# EAGLE design ioboard-right (EAGLE 9.6.2)
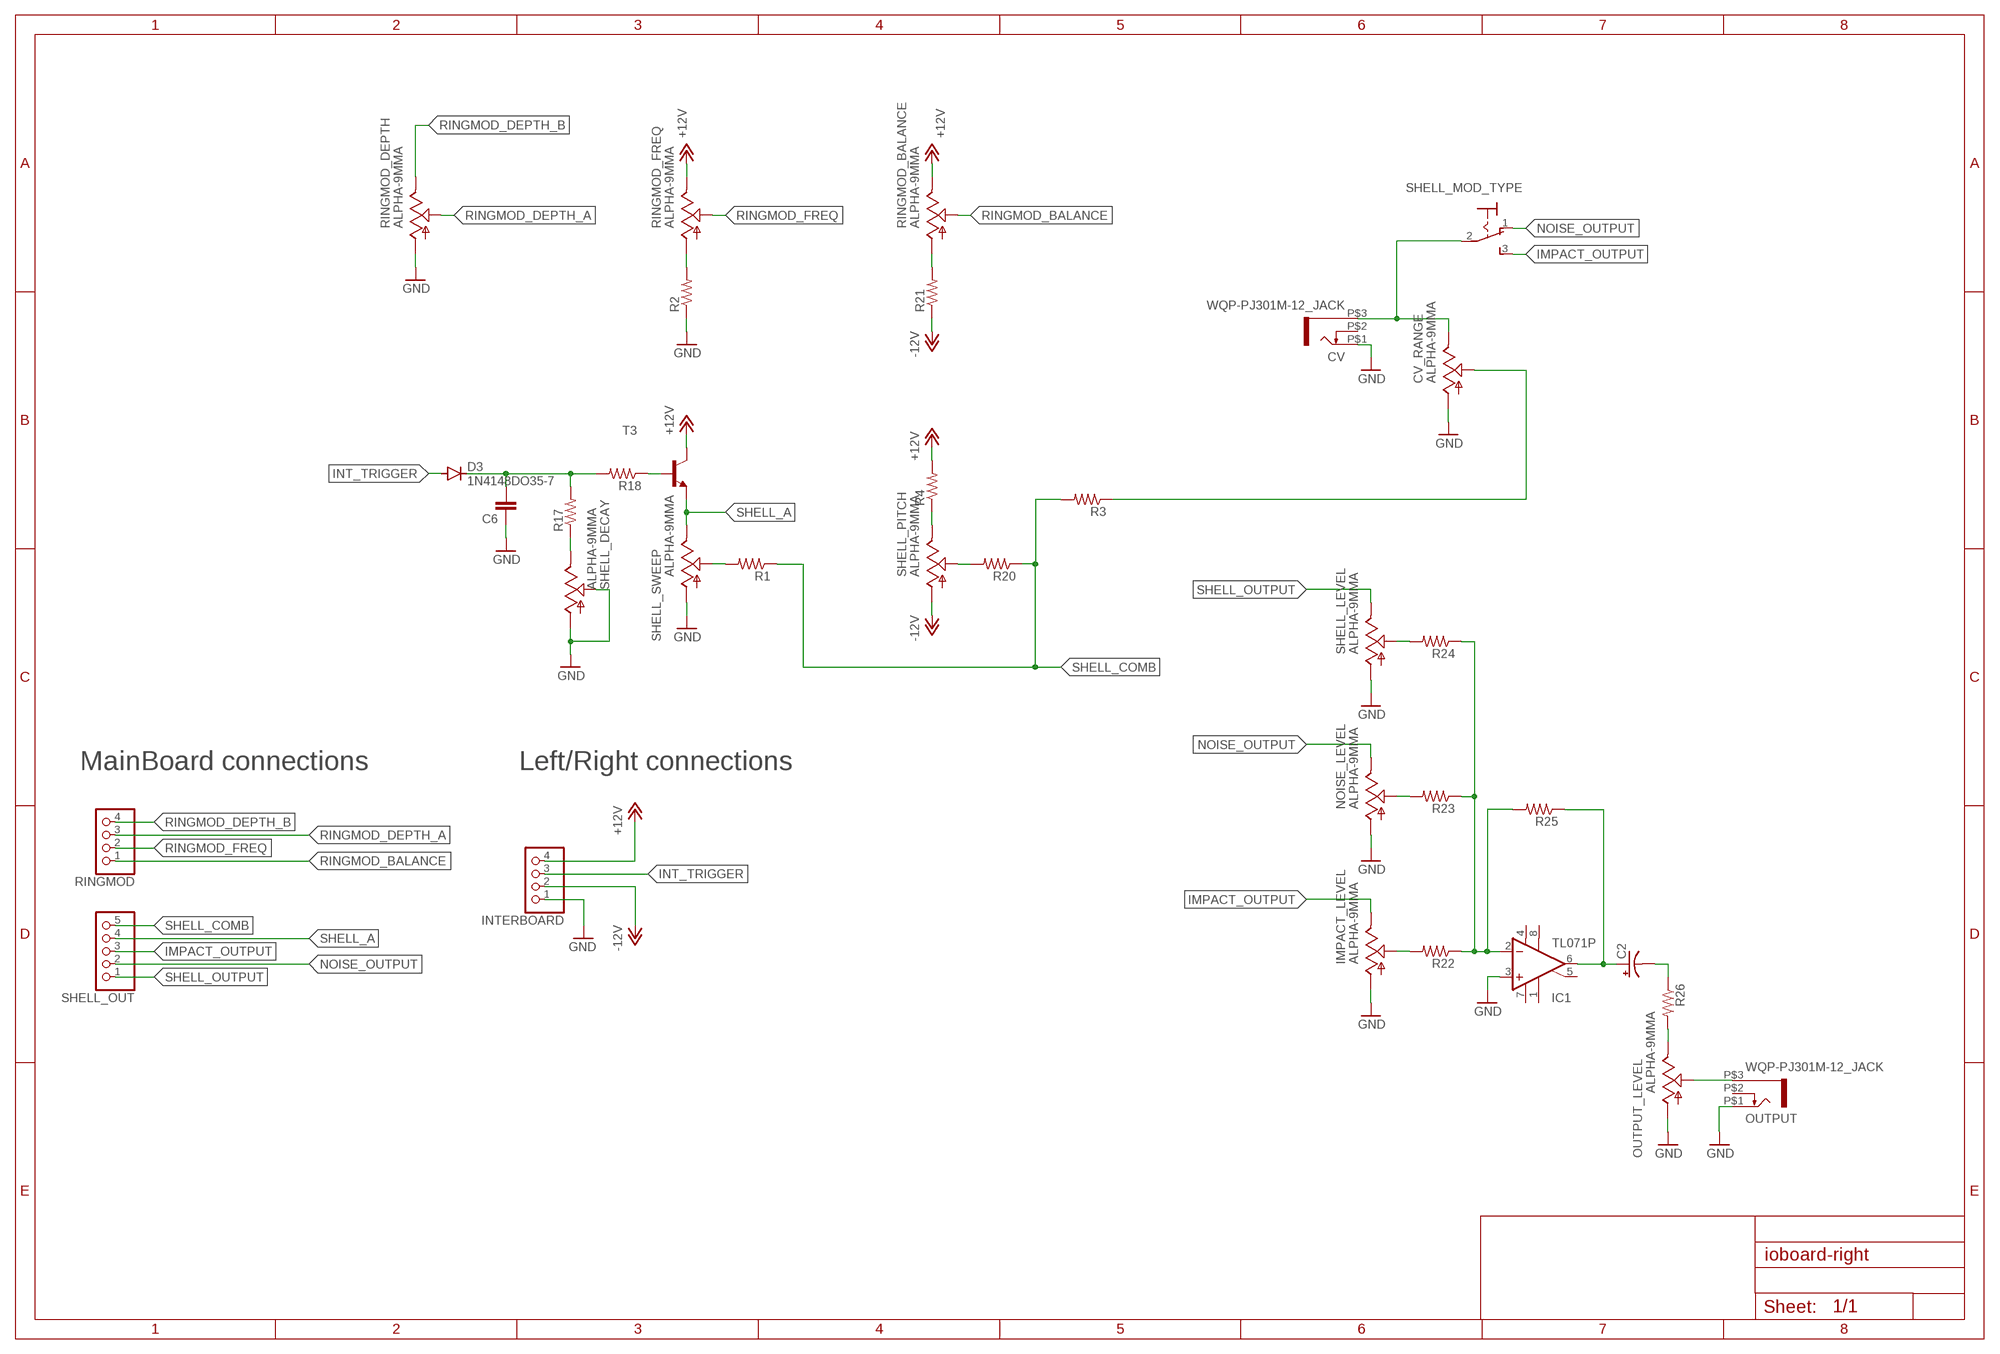
[diagram p0: schematic, sheet 1]

## Parts
C2  CPOL-USE2.5-6  [E2,5-6]
C6  C-EU050-024X044  [C050-024X044]
CV  WQP-PJ301M-12_JACK  [WQP-PJ301M-12_JACK]
CV_RANGE  ALPHA-9MMA  [EVUF]
D3  1N4148DO35-7  [DO35-7]
IC1  TL071P  [DIL08]
IMPACT_LEVEL  ALPHA-9MMA  [EVUF]
INTERBOARD  PINHD-1X4  [1X04]
NOISE_LEVEL  ALPHA-9MMA  [EVUF]
OUTPUT  WQP-PJ301M-12_JACK  [WQP-PJ301M-12_JACK]
OUTPUT_LEVEL  ALPHA-9MMA  [EVUF]
R1  R-US_0207/7  [0207/7]
R2  R-US_0207/7  [0207/7]
R3  R-US_0207/7  [0207/7]
R4  R-US_0207/7  [0207/7]
R17  R-US_0207/7  [0207/7]
R18  R-US_0207/7  [0207/7]
R20  R-US_0207/7  [0207/7]
R21  R-US_0207/7  [0207/7]
R22  R-US_0207/7  [0207/7]
R23  R-US_0207/7  [0207/7]
R24  R-US_0207/7  [0207/7]
R25  R-US_0207/7  [0207/7]
R26  R-US_0207/7  [0207/7]
RINGMOD  PINHD-1X4  [1X04]
RINGMOD_BALANCE  ALPHA-9MMA  [EVUF]
RINGMOD_DEPTH  ALPHA-9MMA  [EVUF]
RINGMOD_FREQ  ALPHA-9MMA  [EVUF]
SHELL_DECAY  ALPHA-9MMA  [EVUF]
SHELL_LEVEL  ALPHA-9MMA  [EVUF]
SHELL_MOD_TYPE  M9040P  [M9040P]
SHELL_OUT  PINHD-1X5  [1X05]
SHELL_PITCH  ALPHA-9MMA  [EVUF]
SHELL_SWEEP  ALPHA-9MMA  [EVUF]
T3  2N3904-NPN-TO92-EBC  [TO92-EBC]

## Nets
+12V: INTERBOARD.4 R4.2 RINGMOD_BALANCE.3(E) RINGMOD_FREQ.3(E) T3.C
-12V: INTERBOARD.2 R21.1 SHELL_PITCH.1(A)
GND: C6.1 CV.P$1 CV_RANGE.1(A) IC1.3(+IN) IMPACT_LEVEL.1(A) INTERBOARD.1 NOISE_LEVEL.1(A) OUTPUT.P$1 OUTPUT_LEVEL.1(A) R2.1 RINGMOD_DEPTH.1(A) SHELL_DECAY.1(A) SHELL_DECAY.2(S) SHELL_LEVEL.1(A) SHELL_SWEEP.1(A)
IMPACT_OUTPUT: IMPACT_LEVEL.3(E) SHELL_MOD_TYPE.3(S) SHELL_OUT.3
INT_TRIGGER: D3.A INTERBOARD.3
N$1: R1.2 SHELL_SWEEP.2(S)
N$3: CV_RANGE.2(S) R3.1
N$24: C6.2 D3.C R17.2 R18.2
N$25: R18.1 T3.B
N$27: R17.1 SHELL_DECAY.3(E)
N$31: R2.2 RINGMOD_FREQ.1(A)
N$32: R21.2 RINGMOD_BALANCE.1(A)
N$34: R4.1 SHELL_PITCH.3(E)
N$35: R20.2 SHELL_PITCH.2(S)
N$37: CV.P$3 CV_RANGE.3(E) SHELL_MOD_TYPE.2(P)
N$39: IMPACT_LEVEL.2(S) R22.2
N$40: NOISE_LEVEL.2(S) R23.2
N$41: R24.2 SHELL_LEVEL.2(S)
N$45: IC1.2(-IN) R22.1 R23.1 R24.1 R25.2
N$46: OUTPUT_LEVEL.3(E) R26.2
N$47: OUTPUT.P$3 OUTPUT_LEVEL.2(S)
N$48: C2.+ IC1.6(OUT) R25.1
N$49: C2.- R26.1
NOISE_OUTPUT: NOISE_LEVEL.3(E) SHELL_MOD_TYPE.1(O) SHELL_OUT.2
RINGMOD_BALANCE: RINGMOD.1 RINGMOD_BALANCE.2(S)
RINGMOD_DEPTH_A: RINGMOD.3 RINGMOD_DEPTH.2(S)
RINGMOD_DEPTH_B: RINGMOD.4 RINGMOD_DEPTH.3(E)
RINGMOD_FREQ: RINGMOD.2 RINGMOD_FREQ.2(S)
SHELL_A: SHELL_OUT.4 SHELL_SWEEP.3(E) T3.E
SHELL_COMB: R1.1 R3.2 R20.1 SHELL_OUT.5
SHELL_OUTPUT: SHELL_LEVEL.3(E) SHELL_OUT.1
Unconnected: CV.P$2 IC1.1(ON1) IC1.5(ON2) IC1.8(OPT) OUTPUT.P$2

## Notes on the sheet
- MainBoard connections | Left/Right connections

## Power pins joined to a net without a drawn wire
V+: IC1.7(V+)
V-: IC1.4(V-)

## Library data of the parts
C2 = rcl:CPOL-US: POLARIZED CAPACITOR, American symbol; SPICEPREFIX: C
C6 = rcl:C-EU: CAPACITOR, European symbol; SPICEPREFIX: C
CV OUTPUT = thonkiconn:WQP-PJ301M-12_JACK
CV_RANGE IMPACT_LEVEL NOISE_LEVEL OUTPUT_LEVEL RINGMOD_BALANCE RINGMOD_DEPTH RINGMOD_FREQ SHELL_DECAY SHELL_LEVEL SHELL_PITCH SHELL_SWEEP = TomW:ALPHA-9MM: 9 mm Square Rotary Potentiometers Source: Panasonic
D3 = diode:1N4148: DIODE high speed (Philips)
IC1 = linear:TL071: OP AMP
INTERBOARD RINGMOD = pinhead:PINHD-1X4: PIN HEADER
R1-R4 R17 R18 R20-R26 = rcl:R-US_: RESISTOR, American symbol; SPICEPREFIX: R
SHELL_MOD_TYPE = switch:M9040P: TOGGLE SWITCH Marquardt
SHELL_OUT = pinhead:PINHD-1X5: PIN HEADER
T3 = transistor-neu-to92:*-NPN-: NPN Transistror

## Board
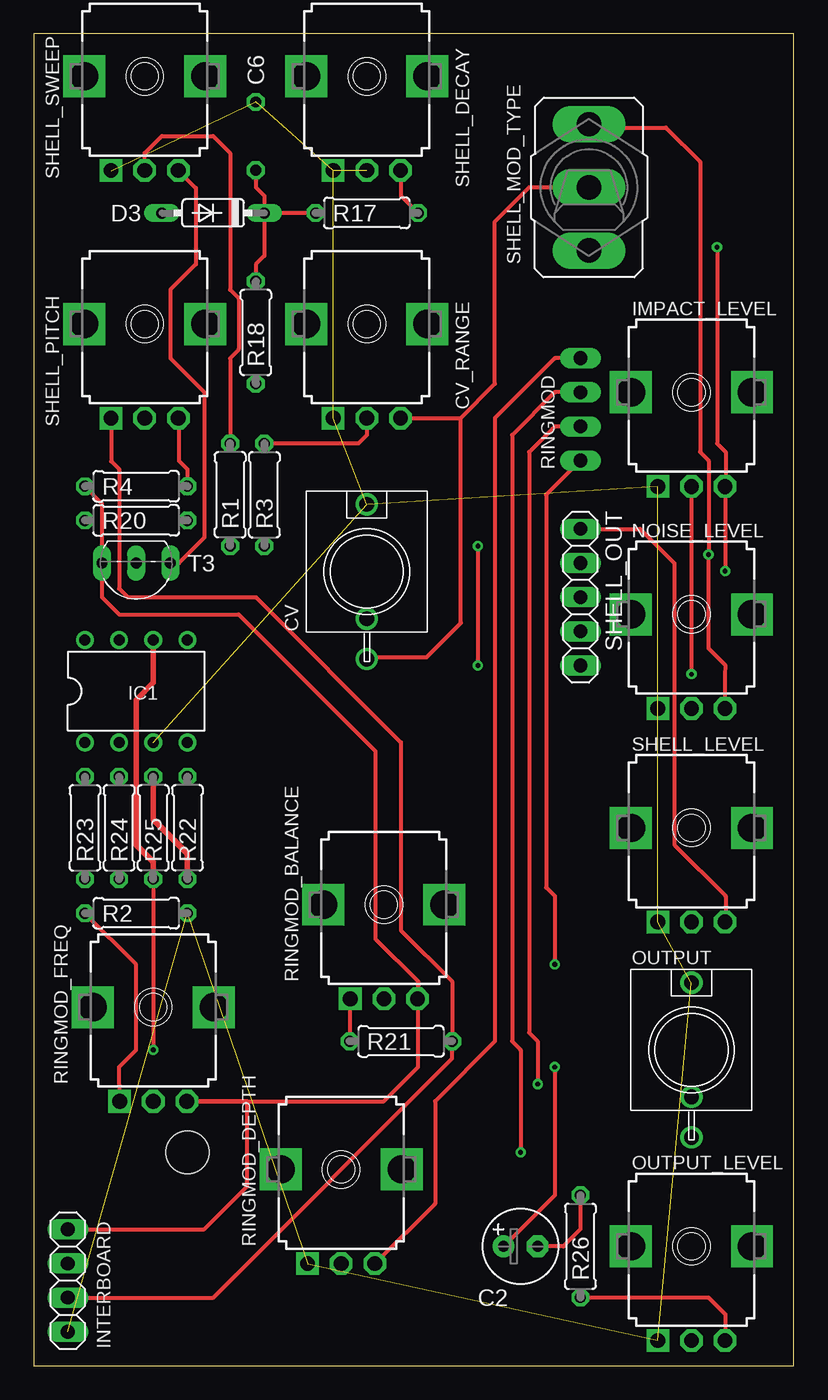
[diagram p1: board, top side]
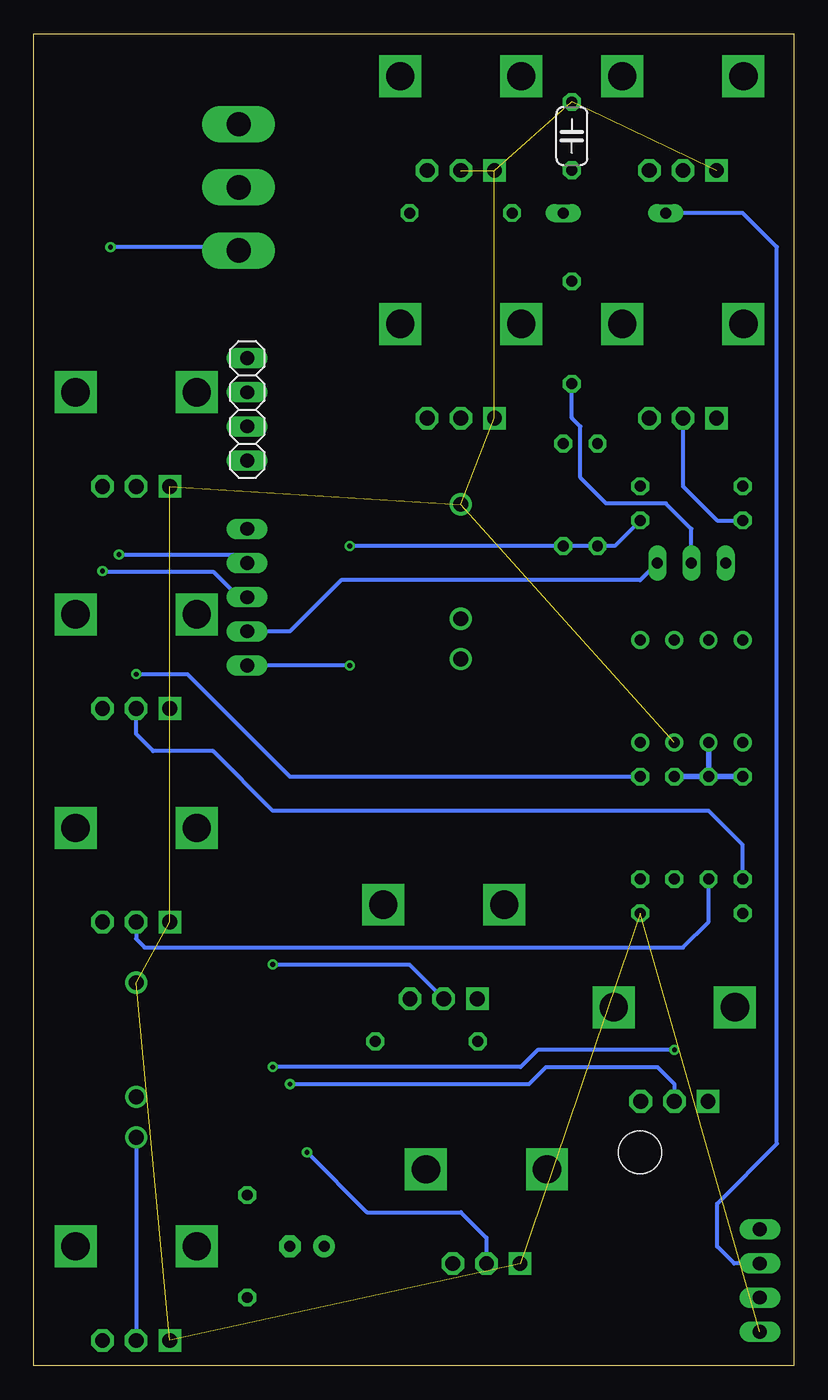
[diagram p2: board, bottom side, seen from below]

Size 56.52 x 99.06 mm. Coordinates in mm from the lower left corner, seen from the top.
Outline: 0,0 56.52,0 56.52,99.06 0,99.05 0,0
Copper layers (1*16): Top 0.035mm / dielectric 1.5mm / Bottom 0.035mm
Design rules "default": minimum track width 6mil, minimum drill 0.35mm, track to track 6mil, track to pad 6mil, pad to pad 6mil, via to via 6mil, smd to smd 6mil, copper to edge 40mil, drill to drill 6mil, minimum pad ring 10mil, minimum via ring 8mil, stop-mask expansion 4mil, vias tented up to drill 0mil, thermal gap 10mil
Holes 3.2 mm at 11.43,15.88

### Footprints (pad centres in the part's own frame; a part is rotated, then mirrored left to right if it is on the bottom)
E2,5-6 = drill 0.813 pad 1.6: + -1.27,0 | drill 0.813 pad 1.6 octagon: - 1.27,0
C050-024X044 = drill 0.813 octagon: 1 -2.54,0; 2 2.54,0
WQP-PJ301M-12_JACK = drill 1.1: P$1 0,5; P$2 0,-3.5; P$3 0,-6.5
EVUF = drill 1.1 pad 1.676 square: 1 -2.5,-7 | drill 1.1 pad 1.676 octagon: 2 0,-7; 3 2.5,-7 | drill 2.1 pad 2.8 square: M1 4.5,0; M2 -4.5,0
DO35-7 = drill 0.813 long: A 3.81,0; C -3.81,0
DIL08 = drill 0.813 pad 1.27: 1 -3.81,-3.81; 2 -1.27,-3.81; 3 1.27,-3.81; 4 3.81,-3.81; 5 3.81,3.81; 6 1.27,3.81; 7 -1.27,3.81; 8 -3.81,3.81
1X04 = drill 1.016 long: 1 -3.81,0; 2 -1.27,0; 3 1.27,0; 4 3.81,0
0207/7 = drill 0.813 octagon: 1 -3.81,0; 2 3.81,0
M9040P = drill 1.803 long: 1 0,4.699; 2 0,0; 3 0,-4.699
1X05 = drill 1.016 long: 1 -5.08,0; 2 -2.54,0; 3 0,0; 4 2.54,0; 5 5.08,0
TO92-EBC = drill 0.813 long: B 0,-1.27; C 2.54,-1.27; E -2.54,-1.27

### Placement (x,y rotation side)
C2  36.2,8.89 0 top
C6  16.51,91.44 270 bottom
CV  24.77,59.05 0 top
CV_RANGE  24.77,77.47 0 top
D3  13.34,85.72 180 top
IC1  7.62,50.16 0 top
IMPACT_LEVEL  48.9,72.39 0 top
INTERBOARD  2.54,6.35 90 top
NOISE_LEVEL  48.9,55.88 0 top
OUTPUT  48.9,23.5 0 top
OUTPUT_LEVEL  48.9,8.89 0 top
R1  14.61,64.77 90 top
R2  7.62,33.66 180 top
R3  17.14,64.77 270 top
R4  7.62,65.41 180 top
R17  24.77,85.72 180 top
R18  16.51,76.83 90 top
R20  7.62,62.87 180 top
R21  27.3,24.13 180 top
R22  11.43,40.01 90 top
R23  3.81,40.01 270 top
R24  6.35,40.01 270 top
R25  8.89,40.01 90 top
R26  40.64,8.89 270 top
RINGMOD  40.64,71.12 90 bottom
RINGMOD_BALANCE  26.04,34.29 0 top
RINGMOD_DEPTH  22.86,14.61 0 top
RINGMOD_FREQ  8.89,26.67 0 top
SHELL_DECAY  24.77,95.89 0 top
SHELL_LEVEL  48.9,40.01 0 top
SHELL_MOD_TYPE  41.27,87.63 0 top
SHELL_OUT  40.64,57.15 270 top
SHELL_PITCH  8.26,77.47 0 top
SHELL_SWEEP  8.26,95.89 0 top
T3  7.62,58.42 180 top

### Tracks (layer width: path | path; a pad name or v marks a point on that pad's centre or on a via)
+12V
  Top 0.305: R4.2 5.08,64.14 T3.C 5.08,57.15 6.35,55.88 15.24,55.88 25.4,45.72 25.4,31.73 28.57,28.57 | INTERBOARD.4 12.7,10.16 15.88,13.34 15.88,19.68 11.43,19.67 | RINGMOD_FREQ.3 26.03,19.68 28.57,22.23 28.57,28.57 | 28.57,28.57 RINGMOD_BALANCE.3
  Top 0.406: 11.43,19.67 RINGMOD_FREQ.3
-12V
  Top 0.305: INTERBOARD.2 13.34,5.08 31.11,22.86 R21.1 31.11,28.57 27.3,32.38 27.3,46.35 16.51,57.15 6.99,57.15 6.35,57.78 6.35,66.67 5.75,67.27 SHELL_PITCH.1
GND  (14 unrouted)
IMPACT_OUTPUT  (via drill 0.35)
  Top 0.305: 51.44,65.39 51.44,67.94 50.8,68.58 v50.8,83.19 | IMPACT_LEVEL.3 v51.4,59.09
  Top 0.406: 51.44,65.39 IMPACT_LEVEL.3
  Bottom 0.305: SHELL_MOD_TYPE.3 arc60 41.27,83.19 v50.8,83.19 | v51.4,59.09 51.44,59.05 43.18,59.05 41.27,57.15 SHELL_OUT.3
INT_TRIGGER
  Bottom 0.305: INTERBOARD.3 4.45,7.62 5.71,8.89 5.71,12.06 1.27,16.51 1.27,83.19 3.81,85.72 D3.A
N$1
  Top 0.305: R1.2 14.61,74.93 15.24,75.56 15.24,79.38 14.61,80.01 14.61,90.17 13.34,91.44 9.53,91.44 8.26,90.17 SHELL_SWEEP.2
N$3
  Top 0.305: CV_RANGE.2 24.77,69.22 24.13,68.58 R3.1
N$24
  Top 0.305: C6.2 16.51,87.63 17.14,87 D3.C | D3.C 17.14,82.55 16.51,81.92 R18.2 | R17.2 D3.C
N$25
  Bottom 0.305: T3.B 7.62,62.23 9.53,64.14 13.97,64.14 15.88,66.04 15.88,69.85 16.51,70.48 R18.1
N$27
  Top 0.305: 27.3,88.84 27.3,87 R17.1
  Top 0.406: SHELL_DECAY.3 27.3,88.84
N$31
  Top 0.305: RINGMOD_FREQ.1 6.35,22.23 7.62,23.5 7.62,29.84 R2.2
N$32
  Top 0.305: 23.5,27.29 R21.2
  Top 0.406: RINGMOD_BALANCE.1 23.5,27.29
N$34
  Top 0.305: 10.79,70.43 10.79,67.31 11.43,66.67 R4.1
  Top 0.406: SHELL_PITCH.3 10.79,70.43
N$35
  Bottom 0.305: SHELL_PITCH.2 8.26,65.41 5.71,62.87 R20.2
N$37
  Top 0.305: SHELL_MOD_TYPE.2 36.83,87.63 34.29,85.09 34.29,73.03 31.75,70.48 | 27.27,70.48 31.75,70.48 | 24.77,52.7 29.21,52.7 31.75,55.24 31.75,70.48
  Top 0.406: CV_RANGE.3 27.27,70.48 | CV.P$3 24.77,52.7
N$39  (via drill 0.35)
  Top 0.305: IMPACT_LEVEL.2 v48.9,51.44
  Bottom 0.305: v48.9,51.44 45.09,51.44 37.47,43.81 R22.2
N$40
  Bottom 0.305: R23.2 3.81,38.73 6.35,41.27 38.73,41.27 43.18,45.72 47.62,45.72 48.9,46.99 NOISE_LEVEL.2
N$41
  Bottom 0.305: SHELL_LEVEL.2 48.9,31.75 48.26,31.11 8.26,31.11 6.35,33.02 R24.2
N$45
  Top 0.406: R25.2 8.89,40.64 11.43,38.1 R22.1
  Bottom 0.406: IC1.2 R24.1 | R24.1 R25.2 | R23.1 R24.1
N$46
  Top 0.305: 51.44,1.91 51.44,3.81 50.16,5.08 R26.2
  Top 0.406: OUTPUT_LEVEL.3 51.44,1.91
N$47
  Bottom 0.305: OUTPUT.P$3 OUTPUT_LEVEL.2
N$48  (via drill 0.35)
  Top 0.305: R25.1 v8.89,23.5 | C2.+ 38.73,12.7 v38.73,22.23
  Top 0.406: IC1.6 8.89,50.8 7.62,49.53 7.62,38.73 8.89,37.47 R25.1
  Bottom 0.305: v8.89,23.5 19.05,23.5 20.32,22.23 v38.73,22.23
N$49
  Top 0.305: R26.1 40.64,10.16 39.37,8.89 C2.-
NOISE_OUTPUT  (via drill 0.35)
  Top 0.305: NOISE_LEVEL.3 51.4,51.4 51.44,52.07 50.16,53.34 v50.16,60.33 50.16,67.31 49.53,67.94 49.53,89.53 46.99,92.08 41.91,92.08 SHELL_MOD_TYPE.1
  Bottom 0.305: SHELL_OUT.2 41.27,60.33 v50.16,60.33
RINGMOD_BALANCE  (via drill 0.35)
  Top 0.305: RINGMOD.1 38.1,64.77 38.1,35.56 38.73,34.92 v38.73,29.84
  Bottom 0.305: v38.73,29.84 28.59,29.84 RINGMOD_BALANCE.2
RINGMOD_DEPTH_A  (via drill 0.35)
  Top 0.305: RINGMOD.3 38.73,72.39 35.56,69.22 35.56,24.13 36.2,23.5 v36.2,15.88
  Bottom 0.305: v36.2,15.88 31.75,11.43 24.77,11.43 22.86,9.53 RINGMOD_DEPTH.2
RINGMOD_DEPTH_B
  Top 0.305: RINGMOD.4 38.73,74.93 34.29,70.48 34.29,24.13 29.84,19.68 29.84,12.06 25.4,7.62 RINGMOD_DEPTH.3
RINGMOD_FREQ  (via drill 0.35)
  Top 0.305: RINGMOD.2 38.73,69.85 36.83,67.94 36.83,24.77 37.47,24.13 v37.47,20.95
  Bottom 0.305: v37.47,20.95 19.68,20.95 18.41,22.23 10.16,22.23 8.89,20.95 RINGMOD_FREQ.2
SHELL_A
  Top 0.305: SHELL_SWEEP.3 12.06,87.58 12.06,81.92 10.16,80.01 10.16,74.93 12.7,72.39 12.7,61.59 10.79,59.69 T3.E
  Bottom 0.305: T3.E 11.43,58.42 33.66,58.42 37.47,54.61 SHELL_OUT.4
SHELL_COMB  (via drill 0.35)
  Top 0.305: v33.02,60.96 v33.02,52.07
  Bottom 0.305: R20.1 13.34,60.96 R1.1 R3.2 v33.02,60.96 | v33.02,52.07 SHELL_OUT.5
SHELL_OUTPUT
  Top 0.305: SHELL_OUT.1 45.09,62.23 47.62,59.69 47.62,38.73 51.44,34.92 51.44,33.05 SHELL_LEVEL.3